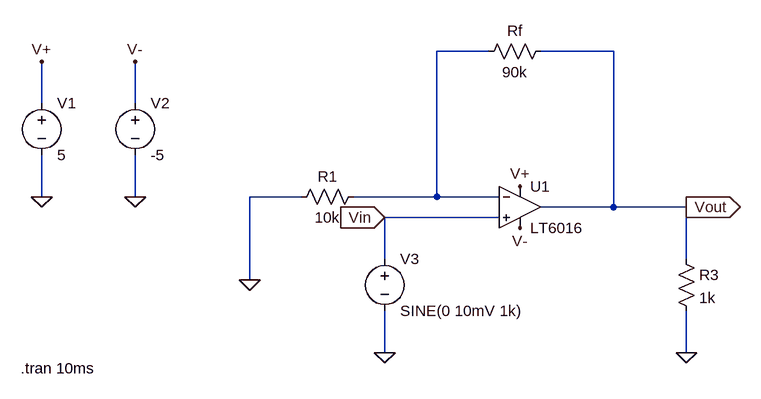
[diagram p0: schematic Task 2.asc]
Task 2.asc, the LTspice schematic file:
Version 4.1
SHEET 1 1104 944
WIRE 688 32 608 32
WIRE 880 32 768 32
WIRE 0 112 0 48
WIRE 144 112 144 48
WIRE 0 256 0 192
WIRE 144 256 144 192
WIRE 400 256 320 256
WIRE 608 256 608 32
WIRE 608 256 480 256
WIRE 704 256 608 256
WIRE 880 272 880 32
WIRE 880 272 768 272
WIRE 992 272 880 272
WIRE 704 288 528 288
WIRE 528 352 528 288
WIRE 992 352 992 272
WIRE 320 384 320 256
WIRE 528 496 528 432
WIRE 992 496 992 432
FLAG 144 256 0
FLAG 0 256 0
FLAG 320 384 0
FLAG 528 496 0
FLAG 992 496 0
FLAG 992 272 Vout
IOPIN 992 272 Out
FLAG 0 48 V+
FLAG 144 48 V-
FLAG 528 288 Vin
IOPIN 528 288 In
FLAG 736 240 V+
FLAG 736 304 V-
SYMBOL voltage 0 96 R0
WINDOW 123 0 0 Left 0
WINDOW 39 0 0 Left 0
SYMATTR InstName V1
SYMATTR Value 5
SYMBOL voltage 144 96 R0
WINDOW 123 0 0 Left 0
WINDOW 39 0 0 Left 0
SYMATTR InstName V2
SYMATTR Value -5
SYMBOL voltage 528 336 R0
WINDOW 123 0 0 Left 0
WINDOW 39 0 0 Left 0
SYMATTR InstName V3
SYMATTR Value SINE(0 10mV 1k)
SYMBOL res 496 240 R90
WINDOW 0 0 56 VBottom 2
WINDOW 3 32 56 VTop 2
SYMATTR InstName R1
SYMATTR Value 10k
SYMBOL res 784 16 R90
WINDOW 0 0 56 VBottom 2
WINDOW 3 32 56 VTop 2
SYMATTR InstName Rf
SYMATTR Value 90k
SYMBOL res 976 336 R0
SYMATTR InstName R3
SYMATTR Value 1k
SYMBOL OpAmps\\LT6016 736 272 R0
SYMATTR InstName U1
TEXT -32 520 Left 2 !.tran 10ms

The netlist it stands for:
* Task 2.asc
V1 V+ 0 5
V2 V- 0 -5
V3 Vin 0 SINE(0 10mV 1k)
R1 N001 0 10k
Rf Vout N001 90k
R3 Vout 0 1k
* U1: LT6016 (symbol OpAmps\LT6016 not available, pins judged from their places): In+=Vin In-=N001 V+=V+ V-=V- OUT=Vout
.tran 10ms
.backanno
.end